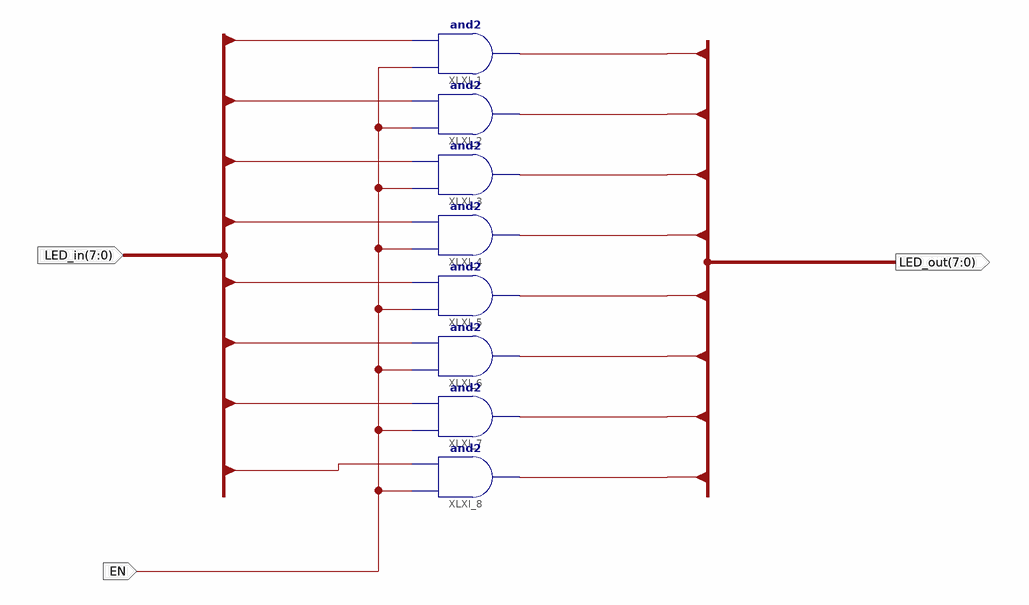
[diagram p0: schematic sheet 1]
// Xilinx ISE schematic LED.sch (spartan6) as structural Verilog: 8 symbols, 3 ports
module LED (
  input  [7:0] LED_in,
  input  EN,
  output [7:0] LED_out
);

  and XLXI_1 (LED_out[7], EN, LED_in[7]);
  and XLXI_2 (LED_out[6], EN, LED_in[6]);
  and XLXI_3 (LED_out[5], EN, LED_in[5]);
  and XLXI_4 (LED_out[4], EN, LED_in[4]);
  and XLXI_5 (LED_out[3], EN, LED_in[3]);
  and XLXI_6 (LED_out[2], EN, LED_in[2]);
  and XLXI_7 (LED_out[1], EN, LED_in[1]);
  and XLXI_8 (LED_out[0], EN, LED_in[0]);
endmodule
